# Altium schematic sheet PWR_SEPIC_N6V.SchDoc: RFSoC_AMC
size 420 x 297 mm; Author: T. Przywozki; CompanyName: WUT ISE; DrawnBy: T. Przywozki; Organization: WUT ISE; Address1: PW ISE; Address2: Nowowiejska 15/19 00-665 Warsaw; Revision: 1.0; SheetNumber: 35; ModifiedBy: -; CheckedDate: -; Title2: 8 channel ADC & DAC; DivGrp: WUT ISE; Designer: T. Przywozki
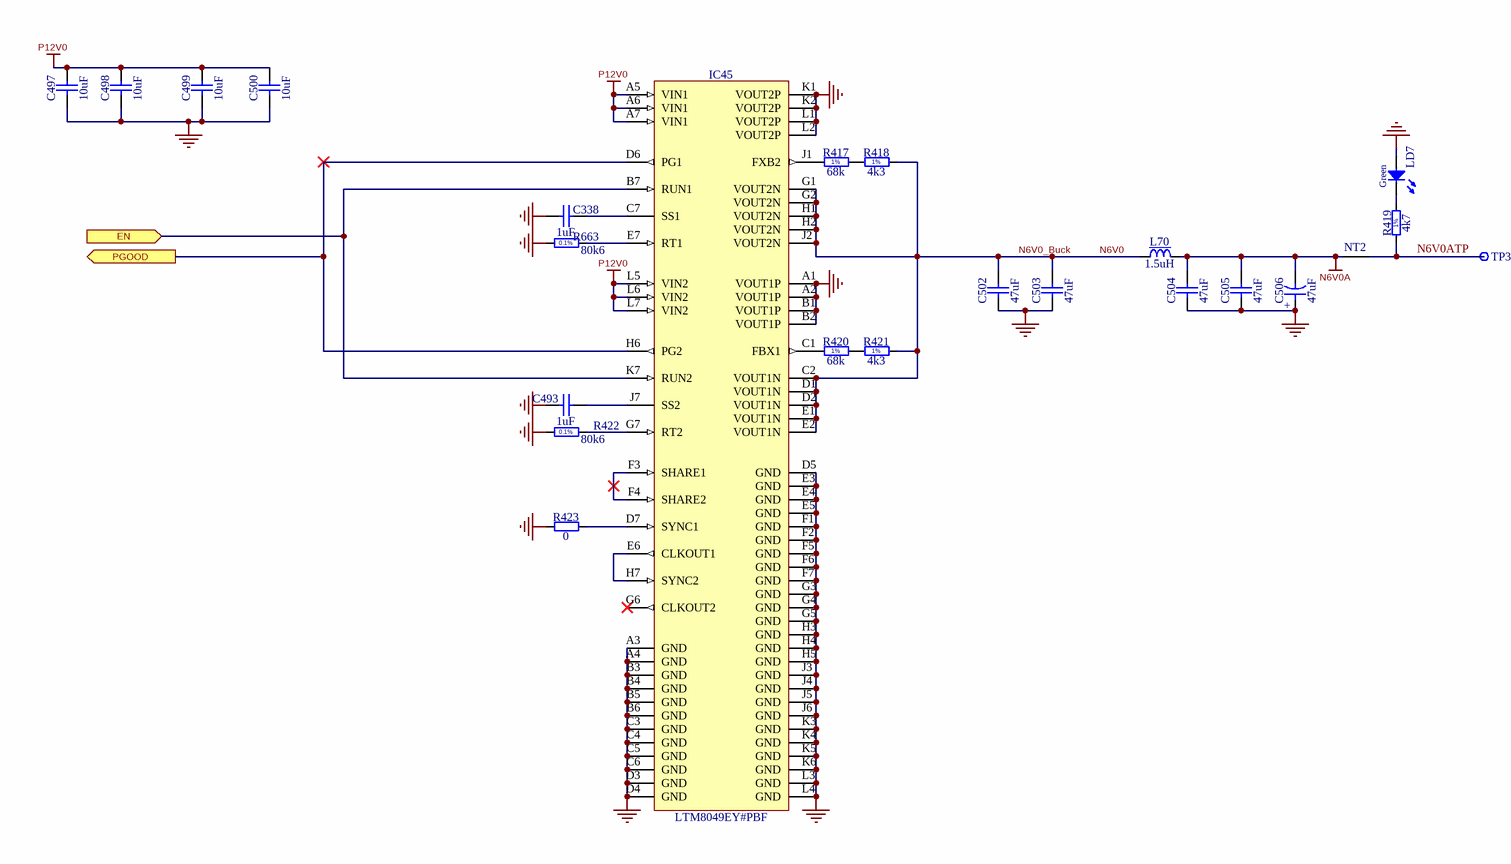
[diagram p0: PWR_SEPIC_N6V.SchDoc]

## Parts
C338  1uF  [CAPC1005X55N]
C493  1uF  [CAPC1005X55N]
C497  10uF  [CAPC2012X95N]
C498  10uF  [CAPC2012X95N]
C499  10uF  [CAPC2012X95N]
C500  10uF  [CAPC2012X95N]
C502  47uF  [CAPC3225X270N]
C503  47uF  [CAPC3225X270N]
C504  47uF  [CAPC3225X270N]
C505  47uF  [CAPC3225X270N]
C506  47uF  [CAPMP6032X280N]
IC45  LTM8049EY#PBF  [BGA77C127P7X11_900X1500X262]
L70  1.5uH  [IND_TDK_SPM6530]
LD7  Green  [LED_KINGBRIGHT_KPH-1608CGCK]
NT2  Net Tie  [Net Tie]  (value not drawn)  (net tie, no BOM)
R417  68k  [RESC1005X40N]
R418  4k3  [RESC1005X40N]
R419  4k7  [RESC1005X40N]
R420  68k  [RESC1005X40N]
R421  4k3  [RESC1005X40N]
R422  80k6  [RESC1608X55N]
R423  0  [RESC1005X40N]
R663  80k6  [RESC1608X55N]
TP36  Test Point  [TPS127]  (value not drawn)

## Ports
EN (in), PGOOD (out)

## Nets
GND: C338.2 C493.2 C497.1 C498.1 C499.1 C500.1 C502.1 C503.1 C504.1 C505.1 C506.1 IC45.A1(VOUT1P) IC45.A2(VOUT1P) IC45.A3(GND) IC45.A4(GND) IC45.B1(VOUT1P) IC45.B2(VOUT1P) IC45.B3(GND) IC45.B4(GND) IC45.B5(GND) IC45.B6(GND) IC45.C3(GND) IC45.C4(GND) IC45.C5(GND) IC45.C6(GND) IC45.D3(GND) IC45.D4(GND) IC45.D5(GND) IC45.E3(GND) IC45.E4(GND) IC45.E5(GND) IC45.F1(GND) IC45.F2(GND) IC45.F5(GND) IC45.F6(GND) IC45.F7(GND) IC45.G3(GND) IC45.G4(GND) IC45.G5(GND) IC45.H3(GND) IC45.H4(GND) IC45.H5(GND) IC45.J3(GND) IC45.J4(GND) IC45.J5(GND) IC45.J6(GND) IC45.K1(VOUT2P) IC45.K2(VOUT2P) IC45.K3(GND) IC45.K4(GND) IC45.K5(GND) IC45.K6(GND) IC45.L1(VOUT2P) IC45.L2(VOUT2P) IC45.L3(GND) IC45.L4(GND) LD7.2(A) R422.1 R423.1 R663.1
N6V0A: C504.2 C505.2 C506.2 L70.2 NT2.1
P12V0: C497.2 C498.2 C499.2 C500.2 IC45.A5(VIN1) IC45.A6(VIN1) IC45.A7(VIN1) IC45.L5(VIN2) IC45.L6(VIN2) IC45.L7(VIN2)
EN: IC45.B7(RUN1) IC45.K7(RUN2) ; port EN
N6V0: C502.2 C503.2 IC45.C2(VOUT1N) IC45.D1(VOUT1N) IC45.D2(VOUT1N) IC45.E1(VOUT1N) IC45.E2(VOUT1N) IC45.G1(VOUT2N) IC45.G2(VOUT2N) IC45.H1(VOUT2N) IC45.H2(VOUT2N) IC45.J2(VOUT2N) L70.1 R418.2 R421.2  [also labelled N6V0_Buck]
N6V0ATP: NT2.2 R419.1 TP36.1
PGOOD: IC45.D6(PG1) IC45.H6(PG2) ; port PGOOD
NetC338_1: C338.1 IC45.C7(SS1)
NetC493_1: C493.1 IC45.J7(SS2)
NetIC45_C1: IC45.C1(FBX1) R420.1
NetIC45_D7: IC45.D7(SYNC1) R423.2
NetIC45_E6: IC45.E6(CLKOUT1) IC45.H7(SYNC2)
NetIC45_E7: IC45.E7(RT1) R663.2
NetIC45_F3: IC45.F3(SHARE1) IC45.F4(SHARE2)
NetIC45_G7: IC45.G7(RT2) R422.2
NetIC45_J1: IC45.J1(FXB2) R417.1
NetLD7_1: LD7.1(C) R419.2
NetR417_2: R417.2 R418.1
NetR420_2: R420.2 R421.1

Not connected (* = marked no-connect by the designer): IC45 G6(CLKOUT2)*

## Notes on the sheet
- Project/Equipment
- Document
- Designer
- Drawn by
- Check.by
- Copyright WUT ISE 2019.
  This documentation describes Open Hardware and is licensed under the CERN OHL v.1.1. You may redistribute and modify this documentation under the terms of the CERN OHL v.1.1. (http://ohwr.org/CERNOHL). This documentation is distributed WITHOUT ANY EXPRESS OR IMPLIED WARRANTY, INCLUDING OF MERCHANTABILITY, SATISFACTORY QUALITY AND FITNESS FOR A PARTICULAR PURPOSE. Please see the CERN OHL v.1.1 for applicable conditions.
- Contact
- File
- Last Mod.
- Print Date
- Sheet
- Size
- A3
- of
- Rev
- (in symbol CTE6032-28_47UF_16V_10%_LESR0350) +
- (in symbol R0402_4K3_1%_0.0625W_100PPM) 1%
- (in symbol R0402_4K7_1%_0.0625W_100PPM) 1%
- (in symbol R0402_68K_1%_0.0625W_100PPM) 1%
- (in symbol R0603_80K6_0.1%_0.063W_10PPM) 0.1%

## Library data of the parts
C338 C493 = CC0402_1UF_16V_10%_X5R: Non-polarised capacitor; Manufacturer: GENERIC; Manufacturer1 Part Number: C1005X5R1C105KT; Part Description: SMD Multilayer Chip Ceramic Capacitor; TC: X5R; Tolerance: ±10%; Voltage: 16V; Case: 0402; Manufacturer Part Number: CC0402_1UF_16V_10%_X5R; Manufacturer1 Example: TDK; Part Number: CC0402_1UF_16V_10%_X5R; Pin Count: 2; SMD: Yes; Status: Preferred; Value: 1uF; Component Kind: Standard; Component Type: Standard; Mounted: Yes; Socket: No; Sense: No; Manufacturer1 ComponentHeight: 0.55mm; HelpURL: \\cern.ch\dfs\Applications\Altium\Datasheets\CC0402_X5R_TDK_C.pdf; Author: CERN DEM JLC; CreateDate: 25.10.2012; LatestRevisionDate: 25.10.2012
C497-C500 = CC0805_10UF_25V_10%_X5R: Non-polarised capacitor; Manufacturer: GENERIC; Part Description: SMD Multilayer Chip Ceramic Capacitor; Manufacturer1 Part Number: GRM219R61E106KA12D; Tolerance: ±10%; Voltage: 25V; TC: X5R; Manufacturer Part Number: CC0805_10UF_25V_10%_X5R; Part Number: CC0805_10UF_25V_10%_X5R; Value: 10uF; Component Kind: Standard; Component Type: Standard; Pin Count: 2; Status: Preferred; Case: 0805; Mounted: Yes; Socket: No; SMD: Yes; Sense: No; Manufacturer1 Example: MURATA; Manufacturer1 ComponentHeight: 0.95mm; HelpURL: \\cern.ch\dfs\Applications\Altium\Datasheets\CC0805_X5R_MURATA_GRM.pdf; Author: CERN DEM JLC; CreateDate: 25/10/2012; LatestRevisionDate: 06/09/2016
C502-C505 = CC1210_47UF_10V_10%_X7R: Non-polarised capacitor; Manufacturer: GENERIC; Part Description: SMD Multilayer Chip Ceramic Capacitor; Manufacturer1 Part Number: GRM32ER71A476KE15; Tolerance: ±10%; Voltage: 10V; TC: X7R; Manufacturer Part Number: CC1210_47UF_10V_10%_X7R; Part Number: CC1210_47UF_10V_10%_X7R; Value: 47uF; Component Kind: Standard; Component Type: Standard; Pin Count: 2; Status: None; Case: 1210; Mounted: Yes; Socket: No; SMD: Yes; Sense: No; Manufacturer1 Example: MURATA; Manufacturer1 ComponentHeight: 2.7mm; HelpURL: \\cern.ch\dfs\Applications\Altium\Datasheets\CC1210_X7R_MURATA.pdf; Author: CERN DEM BC; CreateDate: 18/11/2015; LatestRevisionDate: 18/11/2015
C506 = CTE6032-28_47UF_16V_10%_LESR0350: Polarised capacitor; Manufacturer: GENERIC; Part Description: Low ESR 0R350 Solid Tantalum Chip Capacitor; Manufacturer1 Part Number: TPSC476K016R0350; Tolerance: ±10%; Voltage: 16V; Manufacturer Part Number: CTE6032-28_47UF_16V_10%_LESR0350; Part Number: CTE6032-28_47UF_16V_10%_LESR0350; Value: 47uF; Component Kind: Standard; Component Type: Standard; Pin Count: 2; Status: Preferred; Case: C; Mounted: Yes; Socket: No; SMD: Yes; Sense: No; Manufacturer1 Example: AVX; Manufacturer1 ComponentHeight: 2.8mm; HelpURL: \\cern.ch\dfs\Applications\Altium\Datasheets\CTE-LESR_AVX_TPS.pdf; Author: CERN DEM JLC; CreateDate: 05/05/2008; LatestRevisionDate: 20/01/2009
IC45 = LTM8049EY#PBF: Dual SEPIC or Inverting uModule DC/DC Converter; Manufacturer: LINEAR TECHNOLOGY; PressFit: No; Bonding: No; Part Number: LTM8049EY#PBF; Component Kind: Standard; Component Type: Standard; Device: LTM8049EY#PBF; PackageDescription: BGA, 1.27mm Pitch, Rect.; 77 Pin, 7 Columns X 11 Rows, 9.00mm X 15.00mm X 2.62mm H; Part Description: Dual SEPIC or Inverting uModule DC/DC Converter; Manufacturer Part Number: LTM8049EY#PBF; Pin Count: 77; Case: BGA77; Mounted: Yes; Socket: No; SMD: Yes; Sense: No; ComponentHeight: 2.62mm; HelpURL: \\cern.ch\dfs\Applications\Altium\Datasheets\LTM8049EY#PBF.pdf; Author: CERN DEM JLC; CreateDate: 08.12.2016; LatestRevisionDate: 08.12.2016
L70 = IND_1.5UH_20%_TDK_SPM6530: Inductor With Core; Manufacturer Part Number: SPM6530T-1R5M100; Manufacturer: TDK; Part Description: SMD Inductor for Power Circuits (Wound Metal), SPM Series; Tolerance: ±20%; Power: 11A; Resistance: 0.0097R; Part Number: IND_1.5UH_20%_TDK_SPM6530; Value: 1.5uH; Component Kind: Standard; Component Type: Standard; Pin Count: 2; Status: None; Mounted: Yes; Socket: No; SMD: Yes; Sense: No; ComponentHeight: 3mm; HelpURL: \\cern.ch\dfs\Applications\Altium\Datasheets\IND_TDK_SPM6530.pdf; Author: CERN DEM MR; CreateDate: 08/11/2016; LatestRevisionDate: 08/11/2016
LD7 = LED_KINGBRIGHT_KPH-1608CGCK: LED Green 1C 2A; Part Description: SMD Green LED, Case 1.6mmX0.8mm(0603), 0.65mm Thickness; PressFit: No; Bonding: No; Part Number: LED_KINGBRIGHT_KPH-1608CGCK; Component Kind: Standard; Component Type: Standard; Color: Green; PackageDescription: SMT Green LED, Case 0603, Body L 1.6 x W 0.8mm H 0.65mm; Manufacturer: KINGBRIGHT; Manufacturer Part Number: KPH-1608CGCK; Pin Count: 2; Mounted: Yes; Socket: No; SMD: Yes; Sense: No; ComponentHeight: 0.65mm; HelpURL: \\cern.ch\dfs\Applications\Altium\Datasheets\LED_KINGBRIGHT_KPH-1608CGCK.pdf; Author: CERN DEM JLC; CreateDate: 03/07/2017; LatestRevisionDate: 03/07/2017
NT2 = Net Tie: Part Description: Net Tie (2 Nets); Mounted: No; Part Number: Net Tie; Component Type: Net Tie; Pin Count: 2; Family: Net Tie; Socket: No; SMD: No; Sense: No; Status: None; ComponentHeight: 0mm; HelpURL: Undefined; Author: CERN DEM JLC; CreateDate: 22.03.2011; LatestRevisionDate: 22.03.2011; PackageDescription: 2 Plated Through Hole For Coaxial Cable Link: Hole Dia.=1.4mm Pad Dia.=2.5mm
R417 R420 = R0402_68K_1%_0.0625W_100PPM: Resistor - 1%; Manufacturer: GENERIC; Part Description: General Purpose Thick Film Chip Resistor; Manufacturer1 Part Number: 232270676803L; TC: ±100ppm/°C; PressFit: No; Manufacturer Part Number: R0402_68K_1%_0.0625W_100PPM; Part Number: R0402_68K_1%_0.0625W_100PPM; Tolerance: ±1%; Value: 68k; Component Kind: Standard; Component Type: Standard; Pin Count: 2; Status: Not Recommended; Power: 0.0625W; Case: 0402; Mounted: Yes; Sense: No; Socket: No; SMD: Yes; Manufacturer1 Example: YAGEO PHYCOMP; Manufacturer1 ComponentHeight: 0.4mm; HelpURL: \\cern.ch\dfs\Applications\Altium\Datasheets\R0402_Phycomp_RC0402.pdf; Author: CERN DEM JLC; CreateDate: 03/12/2007; LatestRevisionDate: 17/10/2012
R418 R421 = R0402_4K3_1%_0.0625W_100PPM: Resistor - 1%; Manufacturer: GENERIC; Part Description: General Purpose Thick Film Chip Resistor; Manufacturer1 Part Number: 232270674302L; TC: ±100ppm/°C; PressFit: No; Manufacturer Part Number: R0402_4K3_1%_0.0625W_100PPM; Part Number: R0402_4K3_1%_0.0625W_100PPM; Tolerance: ±1%; Value: 4k3; Component Kind: Standard; Component Type: Standard; Pin Count: 2; Status: Not Recommended; Power: 0.0625W; Case: 0402; Mounted: Yes; Sense: No; Socket: No; SMD: Yes; Manufacturer1 Example: YAGEO PHYCOMP; Manufacturer1 ComponentHeight: 0.4mm; HelpURL: \\cern.ch\dfs\Applications\Altium\Datasheets\R0402_Phycomp_RC0402.pdf; Author: CERN DEM JLC; CreateDate: 03/12/2007; LatestRevisionDate: 17/10/2012
R419 = R0402_4K7_1%_0.0625W_100PPM: Resistor - 1%; Manufacturer: GENERIC; Part Description: General Purpose Thick Film Chip Resistor; Manufacturer1 Part Number: 232270674702L; TC: ±100ppm/°C; PressFit: No; Manufacturer Part Number: R0402_4K7_1%_0.0625W_100PPM; Part Number: R0402_4K7_1%_0.0625W_100PPM; Tolerance: ±1%; Value: 4k7; Component Kind: Standard; Component Type: Standard; Pin Count: 2; Status: Not Recommended; Power: 0.0625W; Case: 0402; Mounted: Yes; Sense: No; Socket: No; SMD: Yes; Manufacturer1 Example: YAGEO PHYCOMP; Manufacturer1 ComponentHeight: 0.4mm; HelpURL: \\cern.ch\dfs\Applications\Altium\Datasheets\R0402_Phycomp_RC0402.pdf; Author: CERN DEM JLC; CreateDate: 03/12/2007; LatestRevisionDate: 17/10/2012
R422 R663 = R0603_80K6_0.1%_0.063W_10PPM: Resistor - 0.1%; Manufacturer: GENERIC; Part Description: Thin Film Chip Resistor; Manufacturer1 Part Number: RN73C1J80K6BTDF; Power: 0.063W; TC: ±10ppm; PressFit: No; Manufacturer Part Number: R0603_80K6_0.1%_0.063W_10PPM; Part Number: R0603_80K6_0.1%_0.063W_10PPM; Tolerance: ±0.1%; Value: 80k6; Component Kind: Standard; Component Type: Standard; Pin Count: 2; Status: Not Recommended; Case: 0603; Mounted: Yes; Sense: No; Socket: No; SMD: Yes; Manufacturer1 Example: TYCO HOLSWORTHY; Manufacturer1 ComponentHeight: 0.5mm; HelpURL: \\cern.ch\dfs\Applications\Altium\Datasheets\R0603_Tyco_RN73.pdf; Author: CERN DEM JLC; CreateDate: 03/12/2007; LatestRevisionDate: 13/03/2008
R423 = R0402_0R_JUMPER: Resistor; Manufacturer: GENERIC; Part Description: 1A (0.05R Max DC Resistance) Zero Ohm Jumper; Manufacturer1 Part Number: 232270591001L; PressFit: No; Manufacturer Part Number: R0402_0R_JUMPER; Part Number: R0402_0R_JUMPER; Value: 0; Component Kind: Standard; Component Type: Standard; Pin Count: 2; Status: Not Recommended; Case: 0402; Mounted: Yes; Sense: No; Socket: No; SMD: Yes; Manufacturer1 Example: YAGEO PHYCOMP; Manufacturer1 ComponentHeight: 0.4mm; HelpURL: \\cern.ch\dfs\Applications\Altium\Datasheets\R0402_Phycomp_RC0402.pdf; Author: CERN DEM JLC; CreateDate: 03/12/2007; LatestRevisionDate: 17/10/2012
TP36 = SMD_PAD_1.27X1.27MM: Part Description: 1.27mm x 1.27mm PCB Copper Area (SMD Test Point); Mounted: No; ComponentHeight: 0mm; Family: Test Point; Part Number: SMD_PAD_1.27X1.27MM; Pin Count: 1; Sense: No; SMD: Yes; Socket: No; Status: None; Component Kind: Standard (No BOM); Component Type: Standard (No BOM); HelpURL: Undefined; Author: CERN DEM JLC; CreateDate: 12.01.2008; LatestRevisionDate: 12.01.2008; PackageDescription: 1.27mm x 1.27mm PCB Copper Area (SMD Test Point)